# EAGLE design nol.board-feather (EAGLE 9.3.2)
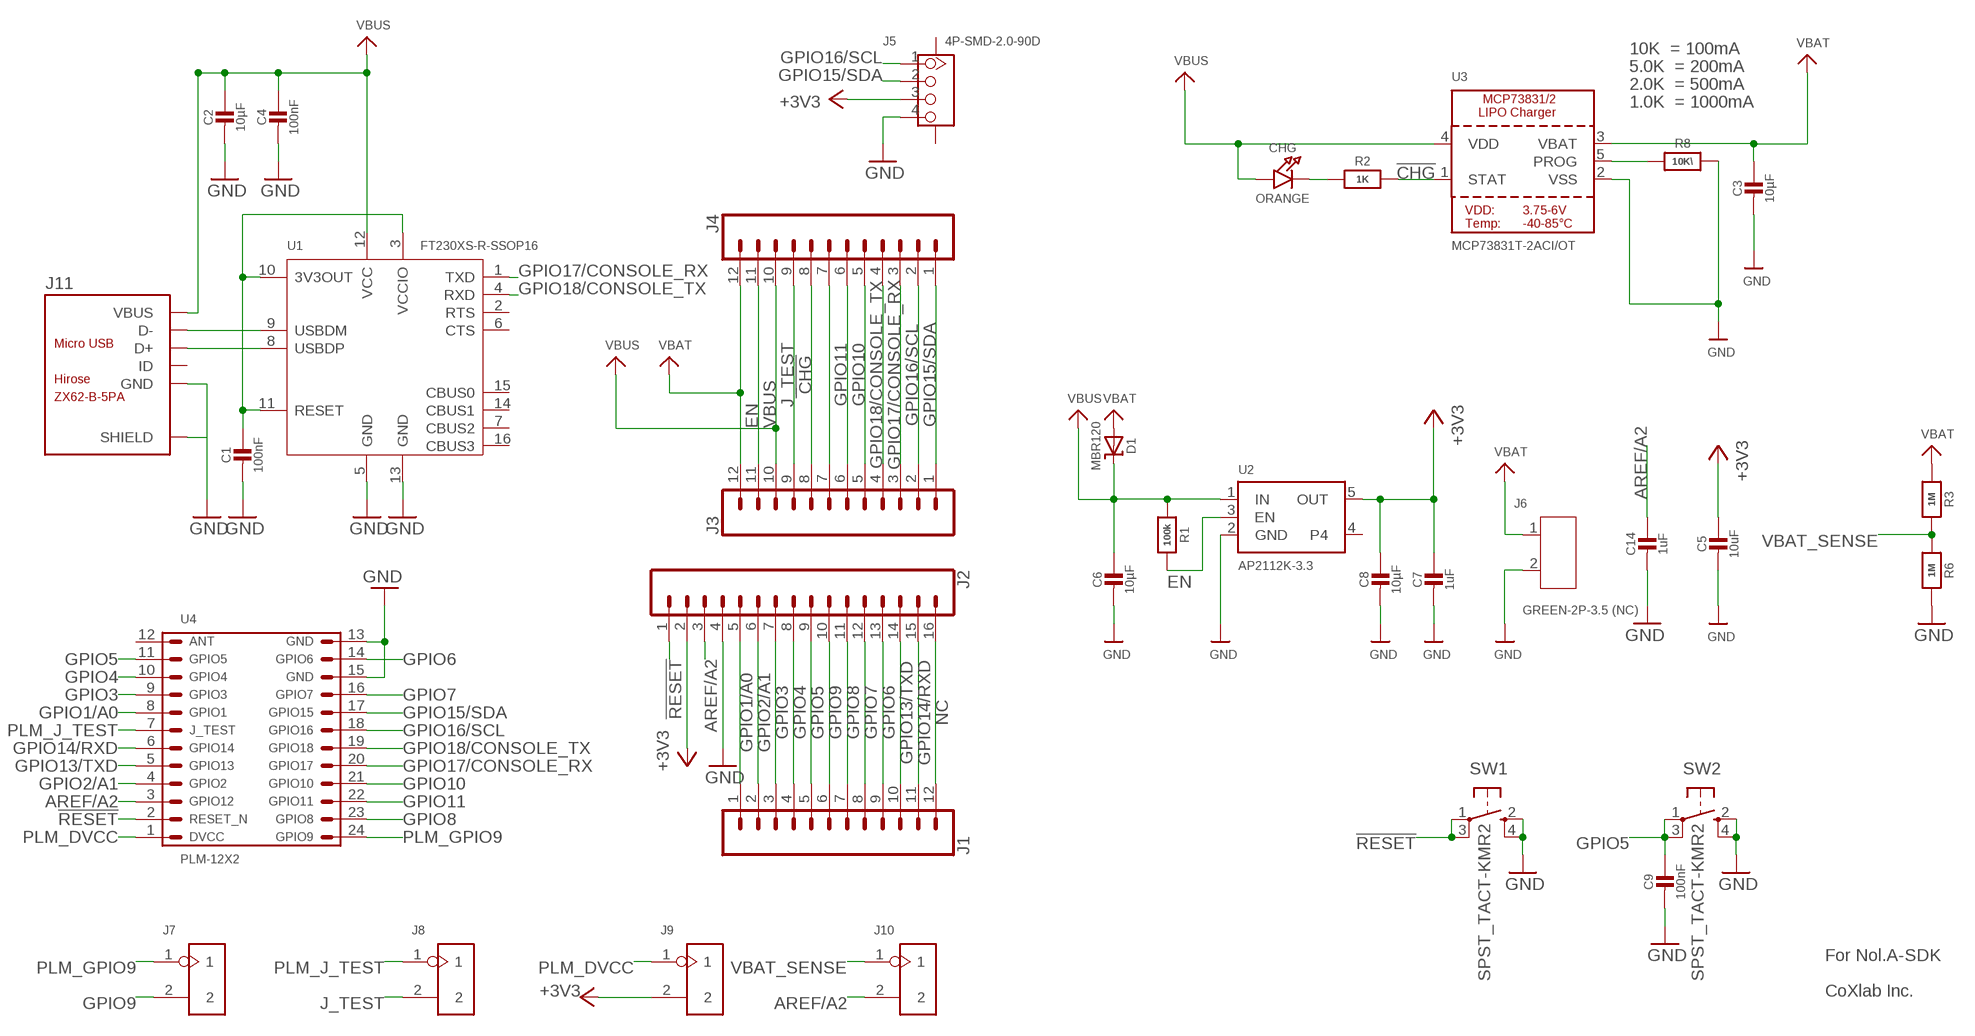
[diagram p0: schematic, sheet 1]

## Parts
C1  100nF  CAP_CERAMIC0805-NOOUTLINE  [0805-NO]
C2  10µF  CAP_CERAMIC0805-NOOUTLINE  [0805-NO]
C3  10µF  CAP_CERAMIC0805-NOOUTLINE  [0805-NO]
C4  100nF  CAP_CERAMIC0805-NOOUTLINE  [0805-NO]
C5  10uF  CAP_CERAMIC0805-NOOUTLINE  [0805-NO]
C6  10µF  CAP_CERAMIC0805-NOOUTLINE  [0805-NO]
C7  1uF  CAP_CERAMIC0603_NO  [0603-NO]
C8  10µF  CAP_CERAMIC0805-NOOUTLINE  [0805-NO]
C9  100nF  CAP_CERAMIC0805-NOOUTLINE  [0805-NO]
C14  1uF  CAP_CERAMIC0603_NO  [0603-NO]
CHG  ORANGE  LED0805_NOOUTLINE  [CHIPLED_0805_NOOUTLINE]
D1  MBR120  DIODE-SCHOTTKYSOD-123  [SOD-123]
J1  CONN_12  [1X12]
J2  CONN_16  [1X16]
J3  CONN_12  [1X12]
J4  CONN_12  [1X12]
J5  4P-SMD-2.0-90D  GROVE-CONNECTOR-SMD-90D(4+2P-2.0)  [HW4-SMD-2.0-90D]
J6  GREEN-2P-3.5 (NC)  SCREW-TERMINAL-GREEN(2P-3.5)  [H2-3.5-7.0X7.0MM]
J7  DIP-BLACK-JUMPER  [H2-2.54]
J8  DIP-BLACK-JUMPER  [H2-2.54]
J9  DIP-BLACK-JUMPER  [H2-2.54]
J10  DIP-BLACK-JUMPER  [H2-2.54]
J11  ZX62-B-5PA  MICRO-USB-SMD(ZX62-B-5PA)  [MICRO-USB5+6P-SMD-0.65-AB]
R1  100k  RESISTOR_0603_NOOUT  [0603-NO]
R2  1K  RESISTOR_0603_NOOUT  [0603-NO]
R3  1M  RESISTOR_0603_NOOUT  [0603-NO]
R6  1M  RESISTOR_0603_NOOUT  [0603-NO]
R8  10K\  RESISTOR_0603_NOOUT  [0603-NO]
SW1  SPST_TACT-KMR2  [KMR2]
SW2  SPST_TACT-KMR2  [KMR2]
U1  FT230XS-R-SSOP16  INTERFACE-FT230XS-R(SSOP16)  [SSOP16-0.635-5X4MM]
U2  AP2112K-3.3  VREG_SOT23-5  [SOT23-5]
U3  MCP73831T-2ACI/OT  MCP73831/2  [SOT23-5]
U4  PLM-12X2  [PLM-12X2]
U$1  COXLAB5X5MM  [COXLAB_5X5MM]
U$7  NOLA10X10MM  [NOLA_10X10MM]

## Nets
!CHG: J3.8 J4.8 R2.2 U3.1(STAT)
!RESET: J2.1 SW1.1(P) SW1.3(P1) U4.2
+3V3: C5.1 C7.1 C8.1 J2.2 J5.3 J9.2 U2.5(OUT)
AREF/A2: C14.1 J2.3 J10.2 U4.3
EN: J3.11 J4.11 R1.2 U2.3(EN)
GND: C1.2 C2.2 C3.2 C4.2 C5.2 C6.2 C7.2 C8.2 C9.2 C14.2 J2.4 J5.4 J6.2 J11.5(GND) J11.P1(SHIELD) J11.P2(SHIELD) J11.P3(SHIELD) J11.P4(SHIELD) J11.P5(SHIELD) J11.P6(SHIELD) R6.2 R8.2 SW1.2(S) SW1.4(S1) SW2.2(S) SW2.4(S1) U1.5(GND) U1.13(GND) U2.2(GND) U3.2(VSS) U4.13 U4.15
GPIO1/A0: J1.1 J2.5 U4.8
GPIO2/A1: J1.2 J2.6 U4.4
GPIO3: J1.3 J2.7 U4.9
GPIO4: J1.4 J2.8 U4.10
GPIO5: C9.1 J1.5 J2.9 SW2.1(P) SW2.3(P1) U4.11
GPIO6: J1.9 J2.13 U4.14
GPIO7: J1.8 J2.12 U4.16
GPIO8: J1.7 J2.11 U4.23
GPIO9: J1.6 J2.10 J7.2
GPIO10: J3.5 J4.5 U4.21
GPIO11: J3.6 J4.6 U4.22
GPIO13/TXD: J1.10 J2.14 U4.5
GPIO14/RXD: J1.11 J2.15 U4.6
GPIO15/SDA: J3.1 J4.1 J5.2 U4.17
GPIO16/SCL: J3.2 J4.2 J5.1 U4.18
GPIO17/CONSOLE_RX: J3.3 J4.3 U1.1(TXD) U4.20
GPIO18/CONSOLE_TX: J3.4 J4.4 U1.4(RXD) U4.19
J_TEST: J3.9 J4.9 J8.2
N$1: J11.2(D-) U1.9(USBDM)
N$2: J11.3(D+) U1.8(USBDP)
N$3: C1.1 U1.3(VCCIO) U1.10(3V3OUT) U1.11(RESET)
N$7: J3.7 J4.7
N$16: CHG.C R2.1
N$29: R8.1 U3.5(PROG)
NC: J1.12 J2.16
PLM_DVCC: J9.1 U4.1
PLM_GPIO9: J7.1 U4.24
PLM_J_TEST: J8.1 U4.7
VBAT: C3.1 D1.A J3.12 J4.12 J6.1 R3.1 U3.3(VBAT)
VBAT_SENSE: J10.1 R3.2 R6.1
VBUS: C2.1 C4.1 C6.1 CHG.A D1.C J3.10 J4.10 J11.1(VBUS) R1.1 U1.12(VCC) U2.1(IN) U3.4(VDD)
Unconnected: J5.SS1 J5.SS2 J11.4(ID) U1.2(RTS) U1.6(CTS) U1.7(CBUS2) U1.14(CBUS1) U1.15(CBUS0) U1.16(CBUS3) U2.4 U4.12

## Notes on the sheet
- 10K  = 100mA
- 5.0K  = 200mA
- 2.0K  = 500mA
- 1.0K  = 1000mA

## Library data of the parts
C1-C9 C14 = microbuilder:CAP_CERAMIC: Ceramic Capacitors For new designs, use the packages preceded by an '_' character since they are more reliable: The following footprints should be used on most boards: _0402 - Standard footprint for regular board layouts _0603 - Standard footprint for regular board layouts _0805 - Standard footprint for regular board layouts _1206 - Standard footprint for regular board layouts For extremely tight-pitch boards where space is at a premium, the following 'micro-pitch' footprints can be used (smaller pads, no silkscreen outline, etc.): _0402MP - Micro-pitch footprint for very dense/compact boards _0603MP - Micro-pitch footprint for very dense/compact boards _0805MP - Micro-pitch footprint for very dense/compact boards _1206MP - Micro-pitch footprint for very dense/compact boards
CHG = microbuilder:LED: LED 0603 - 0603 Surface Mount Package 2mA: Green LED - Low Power (3.9mcd, 2ma, 1.7Vf) - Digikey: 475-2709-2-ND Orange LED - Low Power (9.8mcd, 2ma, 1.8Vf) - Digikey: 475-1194-2-ND Red LED - Low Power (5mcd, 2ma, 1.8Vf) - Digikey: 475-1195-2-ND Yellow LED - Low Power (7mcd, 2ma, 1.8Vf) - Digikey: 475-1196-2-ND 5mA: Blue LED - Low Power (17mcd, 5ma, 2.9Vf) - Digikey: LNJ937W8CRACT-ND 0805 - 0805 Surface Mount Package 2mA: Red LED (8.8mcd, 2mA, 1.8Vf, Clear) - Low Power [Digikey: 475-2510-1-ND] Green LED (5mcd, 2mA, 1.8Vf, Clear) - Low Power [Digikey: 475-2730-1-ND] Yellow LED (11.3mcd, 2mA, 1.8Vf, Clear) - Low Power [Digikey: 475-2555-1-ND] 20mA: Red LED (104mcd, 20mA, Diffused) - LS R976 [Digikey: 475-1278-6-ND] Red LED (12mcd, 20mA, 2.0Vf, Clear) - APT2012EC [Digikey: 754-1128-1-ND] Green LED (15mcd, 20mA, 2.2Vf, Clear) - APT2012GC [Digikey: 754-1131-1-ND] Orange LED (160mcd, 20mA, 2.1Vf, Clear) - APT2012SECK [Digikey: 754-1130-1-ND] 1206 - 1206 Surface Mount Package Green LED (26mcd, 20mA, Diffused) - LG N971 [Digikey: 475-1407-6-ND] Red LED (15mcd, 20mA, Diffused) - LH N974 [Digikey: 475-1416-6-ND] Cree - Cree High-Power Surface Mount LEDs XPEBWT-L1-0000-00D50 - White 111lm 350mA 2.9Vf 6200K 110° XTEAWT-00-0000-00000LEE3 - White 114lm 350mA 2.85Vf 5000K 115° Everlight - Everlight 45-21 Series Surface Mount LEDs 45-21/QK2C-B2832AC2CB2/2T - Warm White 2000mcd 20mA 3.25Vf 3050K 120° 45-21/LK2C-B38452C4CB2/2T - Nuetral White 2000mcd 20mA 3.25Vf 4150K 120° 45-21/LK2C-B50634C6CB2/2T - Cold White 2200mcd 20mA 3.25Vf 5650K 120° PLCC2 Reverse Mount LS T77K-J1L2-1-0-2-R18-Z - Red 11.25mcd 2mA 1.8Vf 630nm 120° LO T77K-L1M2-24-Z - Orange 19.6mcd 2mA 1.8Vf 606nm 120° LY T77K-K2M1-26-Z - Yellow 15.7mcd 2mA 1.8Vf 587nm 120°
D1 = microbuilder:DIODE-SCHOTTKY
J1 J3 J4 = SparkFun-Connectors:CONN_12: Multi connection point. Often used as Generic Header-pin footprint for 0.1 inch spaced/style header connections On any of the 0.1 inch spaced packages, you can populate with these: Break Away Headers - Straight <https://www.sparkfun.com/products/116> (PRT-00116) Break Away Male Headers - Right Angle <https://www.sparkfun.com/products/553> (PRT-00553) Female Headers <https://www.sparkfun.com/products/115> (PRT-00115) Break Away Headers - Machine Pin <https://www.sparkfun.com/products/117> (PRT-00117) Break Away Female Headers - Swiss Machine Pin <https://www.sparkfun.com/products/743> (PRT-00743) For SCREWTERMINALS and SPRING TERMINALS visit here: Screw Terimnals on SparkFun.com <https://www.sparkfun.com/search/results?term=Screw+Terminals> (5mm/3.5mm/2.54mm spacing) This device is also useful as a general connection point to wire up your design to another part of your project. Our various solder wires solder well into these plated through hole pads. Hook-Up Wire - Assortment (Stranded, 22 AWG) <https://www.sparkfun.com/products/11375> (PRT-11375) Hook-Up Wire - Assortment (Solid Core, 22 AWG) <https://www.sparkfun.com/products/11367> (PRT-11367) View the entire wire category on our website here <https://www.sparkfun.com/categories/141> Special notes: Molex polarized connector foot print use with SKU : PRT-08231 with associated crimp pins and housings. 1MM SMD Version SKU: PRT-10208 NOTES ON THE VARIANTS LOCK and LOCK_LONGPADS... This footprint was designed to help hold the alignment of a through-hole component (i.e. 6-pin header) while soldering it into place. You may notice that each hole has been shifted either up or down by 0.005 of an inch from it's more standard position (which is a perfectly straight line). This slight alteration caused the pins (the squares in the middle) to touch the edges of the holes. Because they are alternating, it causes a "brace" to hold the component in place. 0.005 has proven to be the perfect amount of "off-center" position when using our standard breakaway headers. Although looks a little odd when you look at the bare footprint, once you have a header in there, the alteration is very hard to notice. Also,if you push a header all the way into place, it is covered up entirely on the bottom side.
J2 = SparkFun-Connectors:CONN_16: Multi connection point. Often used as Generic Header-pin footprint for 0.1 inch spaced/style header connections On any of the 0.1 inch spaced packages, you can populate with these: Break Away Headers - Straight <https://www.sparkfun.com/products/116> (PRT-00116) Break Away Male Headers - Right Angle <https://www.sparkfun.com/products/553> (PRT-00553) Female Headers <https://www.sparkfun.com/products/115> (PRT-00115) Break Away Headers - Machine Pin <https://www.sparkfun.com/products/117> (PRT-00117) Break Away Female Headers - Swiss Machine Pin <https://www.sparkfun.com/products/743> (PRT-00743) For SCREWTERMINALS and SPRING TERMINALS visit here: Screw Terimnals on SparkFun.com <https://www.sparkfun.com/search/results?term=Screw+Terminals> (5mm/3.5mm/2.54mm spacing) This device is also useful as a general connection point to wire up your design to another part of your project. Our various solder wires solder well into these plated through hole pads. Hook-Up Wire - Assortment (Stranded, 22 AWG) <https://www.sparkfun.com/products/11375> (PRT-11375) Hook-Up Wire - Assortment (Solid Core, 22 AWG) <https://www.sparkfun.com/products/11367> (PRT-11367) View the entire wire category on our website here <https://www.sparkfun.com/categories/141> Special notes: Molex polarized connector foot print use with SKU : PRT-08231 with associated crimp pins and housings. 1MM SMD Version SKU: PRT-10208 NOTES ON THE VARIANTS LOCK and LOCK_LONGPADS... This footprint was designed to help hold the alignment of a through-hole component (i.e. 6-pin header) while soldering it into place. You may notice that each hole has been shifted either up or down by 0.005 of an inch from it's more standard position (which is a perfectly straight line). This slight alteration caused the pins (the squares in the middle) to touch the edges of the holes. Because they are alternating, it causes a "brace" to hold the component in place. 0.005 has proven to be the perfect amount of "off-center" position when using our standard breakaway headers. Although looks a little odd when you look at the bare footprint, once you have a header in there, the alteration is very hard to notice. Also,if you push a header all the way into place, it is covered up entirely on the bottom side.
J5 = OPL_Connector:GROVE-CONNECTOR-SMD-90D(4+2P-2.0): 320110032
J6 = OPL_Connector:SCREW-TERMINAL-GREEN(2P-3.5): 320110028; VALUE: GREEN-2P-3.5
J7-J10 = OPL_Connector:DIP-BLACK-JUMPER: 320190003
J11 = OPL_Connector:MICRO-USB-SMD(ZX62-B-5PA): 320010005; MPN: ZX62-B-5PA
R1-R3 R6 R8 = microbuilder:RESISTOR: Resistors For new designs, use the packages preceded by an '_' character since they are more reliable: The following footprints should be used on most boards: _0402 - Standard footprint for regular board layouts _0603 - Standard footprint for regular board layouts _0805 - Standard footprint for regular board layouts _1206 - Standard footprint for regular board layouts For extremely tight-pitch boards where space is at a premium, the following 'micro-pitch' footprints can be used (smaller pads, no silkscreen outline, etc.): _0402MP - Micro-pitch footprint for very dense/compact boards _0603MP - Micro-pitch footprint for very dense/compact boards _0805MP - Micro-pitch footprint for very dense/compact boards _1206MP - Micro-pitch footprint for very dense/compact boards
SW1 SW2 = adafruit:SPST_TACT: SMT 6mm switch, EVQQ2 series http://www.ladyada.net/library/eagle
U1 = OPL_IC:INTERFACE-FT230XS-R(SSOP16): 310070030; MPN: FT230XS-R
U2 = microbuilder:VREG_SOT23-5: SOT23-5 Fixed Voltage Regulators Part Current Out V Out V In V Dropout θJA (°C/W) TJ (°C) Digikey Part No. ADP121 150mA 3.3V 3.4-5.5V 0.09V @ 150mA -- -- ADP121-AUJZ33R7CT-ND ADP121 150mA 3.0V 3.1-5.5V 0.09V @ 150mA -- -- ADP121-AUJZ30R7CT-ND ADP122 300mA 3.3V 3.4-5.5V 0.085V @ 300mA -- -- ADP122AUJZ-3.3-R7CT-ND ADP1712 300mA 3.3V 3.5-5.5V 0.17V @ 300mA -- -- ADP1712AUJZ-3.3-R7TR-ND AP7311 (Low Cost) 150mA 3.3V 3.5-6V 0.15V @ 150mA -- -- AP7311-33WG-7DICT-ND LD39015M18R 150mA 1.8V 1.9V-5.5V 0.08V @ 100mA -- -- 497-6977-1-ND LP2985A-33DBVR 150mA 3.3V 3.3-16V 0.28V @ 150mA 206 150 296-18479-1-ND MCP1824T-3302E/OT 300mA 3.3V 3.5V-6V 0.2V @ 300mA -- -- MCP1824T-3302E/OTCT-ND MIC5205-2.5YM5 TR 150mA 2.5V 2.7-16V 0.165V @ 150mA -- -- 576-1257-2-ND MIC5205-3.0YM5 TR 150mA 3.0V 3.2V-16V 0.165V @ 150mA -- -- 576-1258-2-ND MIC5205-3.3YM5 TR 150mA 3.3V 3.5V-16V 0.165V @ 150mA -- -- 576-1259-2-ND TPS780330220 150mA 3.3V+2.2V 3.6-5.5V 250mV Max -- -- 296-23332-1-ND TDA3663/N1,135 100mA 3.3V 3.5-45V 0.18V @ 50mA -- -- 568-5343-1-ND Max operating temp can be calculated using θJA, TJ (max junction temperature), and power in watts. Set the "Maximum Ambient Temperature" until it reaches TJ ("Max Junction Temperature"), which is the absolute limit for safe use of the regulator: Heat Sink Temperature Calculator <http://www.daycounter.com/Calculators/Heat-Sink-Temperature-Calculator.phtml> For example, With 12V source into a 3.3V LP2985 and a 30mA load, we are dissipating (12V-3.3V) * 0.03A = 0.261W. With a θJA of 206 °C/W, a TJ of 150°C, and 261mW we can safely use the chip without a heat sink up to 75°C (=147.1°C Junction Temperature).
U3 = microbuilder:MCP73831/2: MCP73831/2 LIPO Charger VDD: 3.75 - 6V Temp -40 - 85°C Programmable Charge Rate: 15-500mA NOTE: STAT is a tri-state logic output on the MCP73831 and an open-drain output on the MCP73832. SOT23-5 with 4.2V output and tri-state logic on STAT = MCP73831T-2ACI/OT
U4 = plm:PLM-12X2
U$1 = coxlab:COXLAB
U$7 = coxlab:NOLA

## Board
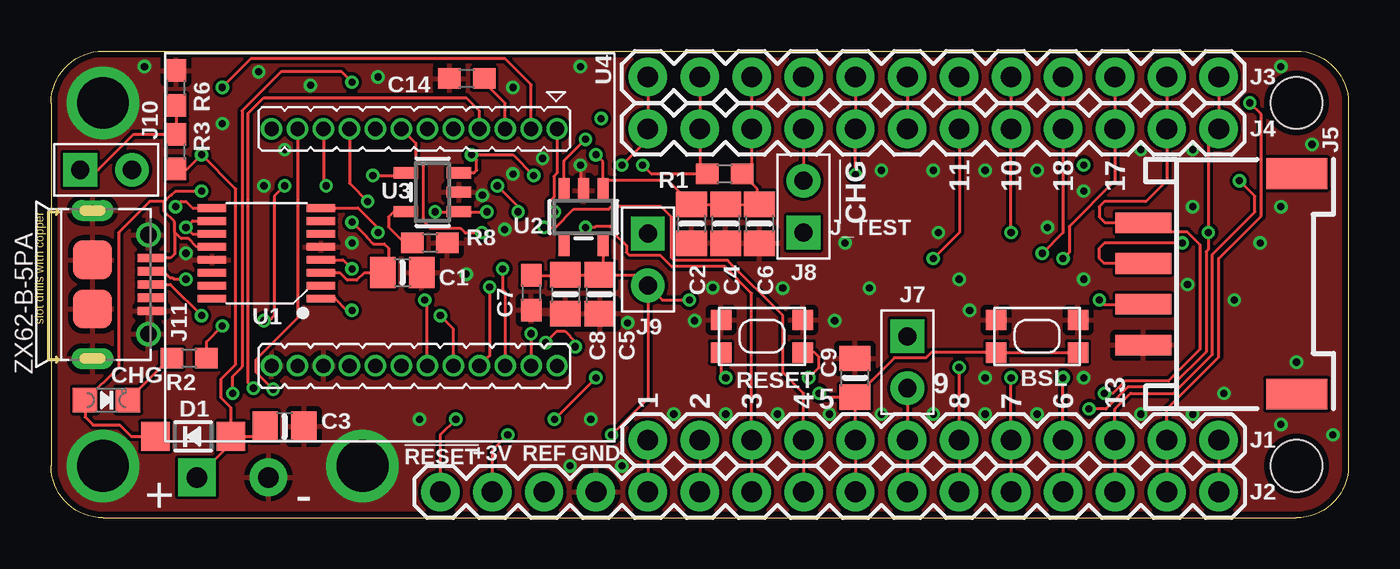
[diagram p1: board, top side]
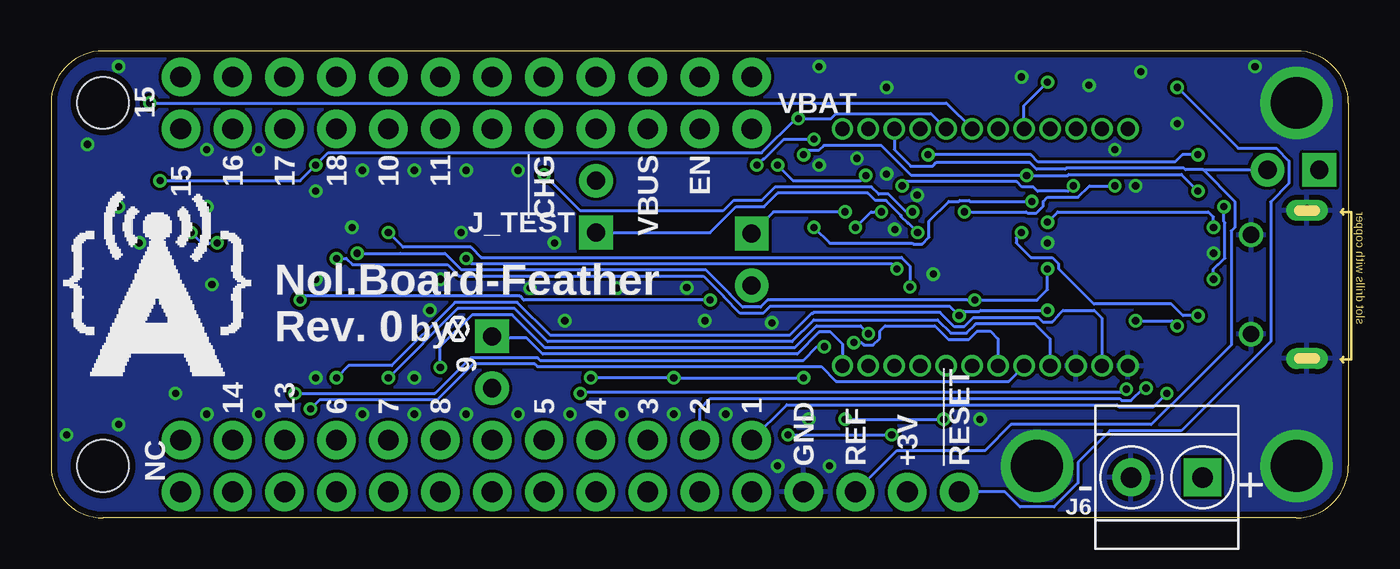
[diagram p2: board, bottom side, seen from below]

Size 63.5 x 22.86 mm. Coordinates in mm from the lower left corner, seen from the top.
Outline: 2.54,0 60.96,0 arc90 63.5,2.54 63.5,20.32 arc90 60.96,22.86 2.54,22.86 arc90 0,20.32 0,2.54 arc90 2.54,0
Copper layers (1*16): Top 0.035mm / dielectric 1.5mm / Bottom 0.035mm
Design rules "SeeedStudio_2layer_DRU_no_angle_20140221 *": minimum track width 6mil, minimum drill 0.2mm, track to track 6mil, track to pad 6mil, pad to pad 6mil, via to via 6mil, smd to smd 0mil, copper to edge 12mil, drill to drill 12mil, minimum pad ring 6mil, minimum via ring 6mil, stop-mask expansion 2mil, vias tented up to drill 100mil, thermal gap 10mil
Holes 2.54 mm at 60.96,20.32 60.96,2.54

### Footprints (pad centres in the part's own frame; a part is rotated, then mirrored left to right if it is on the bottom)
0805-NO = smd 1.24 x 1.5: 1 -0.95,0; 2 0.95,0
0603-NO = smd 1.1 x 1: 1 -0.85,0; 2 0.85,0
CHIPLED_0805_NOOUTLINE = smd 1.2 x 1.2: A 0,-1.05; C 0,1.05
SOD-123 = smd 1.4 x 1.4: A 1.85,0; C -1.85,0
1X12 = drill 1.016 pad 1.88: 1 0,0; 2 2.54,0; 3 5.08,0; 4 7.62,0; 5 10.16,0; 6 12.7,0; 7 15.24,0; 8 17.78,0; 9 20.32,0; 10 22.86,0; 11 25.4,0; 12 27.94,0
1X16 = drill 1.016 pad 1.88: 1 0,0; 2 2.54,0; 3 5.08,0; 4 7.62,0; 5 10.16,0; 6 12.7,0; 7 15.24,0; 8 17.78,0; 9 20.32,0; 10 22.86,0; 11 25.4,0; 12 27.94,0; 13 30.48,0; 14 33.02,0; 15 35.56,0; 16 38.1,0
HW4-SMD-2.0-90D = smd 1.01 x 2.74: 1 -3,-0.1; 2 -1,-0.1; 3 1,-0.1; 4 3,-0.1 | smd 1.5 x 3: SS1 -5.4,7.4; SS2 5.4,7.4
H2-3.5-7.0X7.0MM = drill 1 pad 1.85 square: 1 -1.75,0 | drill 1 pad 1.85: 2 1.75,0
H2-2.54 = drill 0.889 pad 1.651 square: 1 0,1.27 | drill 0.889 pad 1.651: 2 0,-1.27
MICRO-USB5+6P-SMD-0.65-AB = smd 0.4 x 1.35: 1 -1.3,2.875; 2 -0.65,2.875; 3 0,2.875; 4 0.65,2.875; 5 1.3,2.875 | smd 1.9 x 1.9: P1 -1.2,0; P2 1.2,0 | drill 0.508 pad 1.016 long: P3 -3.625,0; P4 3.625,0 | drill 0.8: P5 -2.425,2.73; P6 2.425,2.73
KMR2 = smd 1 x 1: 1 2,0.8; 2 2,-0.8; 3 -2,0.8; 4 -2,-0.8
SSOP16-0.635-5X4MM = smd 0.381 x 1.397: 1 -2.223,-2.667; 2 -1.587,-2.667; 3 -0.953,-2.667; 4 -0.318,-2.667; 5 0.318,-2.667; 6 0.953,-2.667; 7 1.587,-2.667; 8 2.223,-2.667; 9 2.223,2.667; 10 1.587,2.667; 11 0.953,2.667; 12 0.318,2.667; 13 -0.318,2.667; 14 -0.953,2.667; 15 -1.587,2.667; 16 -2.223,2.667
SOT23-5 = smd 0.55 x 1.2: 1 -0.95,-1.3; 2 0,-1.3; 3 0.95,-1.3; 4 0.95,1.3; 5 -0.95,1.3
PLM-12X2 = drill 0.7 pad 1.016: 1 0,0; 2 1.27,0; 3 2.54,0; 4 3.81,0; 5 5.08,0; 6 6.35,0; 7 7.62,0; 8 8.89,0; 9 10.16,0; 10 11.43,0; 11 12.7,0; 12 13.97,0; 13 13.97,11.608; 14 12.7,11.608; 15 11.43,11.608; 16 10.16,11.608; 17 8.89,11.608; 18 7.62,11.608; 19 6.35,11.608; 20 5.08,11.608; 21 3.81,11.608; 22 2.54,11.608; 23 1.27,11.608; 24 0,11.608

### Placement (x,y rotation side)
C1  17.2,12.01 0 top
C2  31.34,14.4 270 top
C3  11.43,4.47 0 top
C4  33.02,14.4 270 top
C5  26.87,10.95 270 top
C6  34.67,14.4 270 top
C7  23.5,11.02 270 top
C8  25.17,10.95 270 top
C9  39.34,6.86 90 top
C14  20.35,21.51 180 top
CHG  2.72,5.77 270 top
D1  6.96,3.99 0 top
J1  29.21,3.81 0 top
J2  19.05,1.27 0 top
J3  57.15,21.59 180 top
J4  57.15,19.05 180 top
J5  53.57,11.46 270 top
J6  8.89,1.98 180 bottom
J7  41.91,7.62 0 top
J8  36.83,15.24 180 top
J9  29.21,12.65 0 top
J10  2.69,17.04 90 top
J11  2.03,11.43 270 top
R1  32.97,16.84 180 top
R2  6.76,7.82 0 top
R3  6.12,17.93 90 top
R6  6.12,21.06 90 top
R8  18.54,13.46 0 top
SW1  34.8,8.89 180 top
SW2  48.26,8.89 180 top
U1  10.54,12.95 90 top
U2  26.06,14.73 180 top
U3  18.67,15.95 90 top
U4  24.77,19.05 180 top
U$1  44.2,8.64 0 bottom
U$7  63.25,6.6 0 bottom

### Tracks (layer width: path | path; a pad name or v marks a point on that pad's centre or on a via)
!CHG  (via drill 0.35)
  Top 0.152: U3.1 19.98,14.99 | 19.98,14.99 v21.34,14.99 | v18.8,14.99 19.98,14.99 | v11.43,16.26 10.92,15.75 10.92,9.91 10.67,9.65 v10.41,9.65 | R2.2 7.61,8.62 v8.38,9.4 | v39.37,16.8 J4.8 J3.8
  Bottom 0.152: v18.8,14.99 15.77,14.99 15.72,14.94 15.26,14.94 14.94,15.26 14.94,15.49 14.73,15.7 13.23,15.7 12.68,16.26 v11.43,16.26 | v10.41,9.65 8.64,9.65 v8.38,9.4 | v39.37,16.8 37.59,15.02 30.62,15.02 30.1,15.54 28.73,15.54 28.07,16.2 23.34,16.2 22.98,15.85 22.5,15.85 21.64,14.99 v21.34,14.99
!RESET  (via drill 0.35)
  Top 0.152: SW1.1 32.8,7.08 v33.02,6.86 | v37.08,6.86 37.59,7.37 37.59,7.87 37.38,8.09 SW1.3 | v26.67,6.86 v24.64,4.83 | v19.81,4.83 19.05,4.06 J2.1 | U4.2 23.5,21.21 22.23,22.48 9.78,22.48 v8.38,21.08
  Bottom 0.152: v37.08,6.86 v33.02,6.86 v26.67,6.86 | v24.64,4.83 v19.81,4.83 | v8.38,21.08 5.4,18.1 3.53,18.1 2.91,17.48 2.91,16.37 3.81,15.47 3.81,8.64 8.18,4.27 11.68,4.27 13.23,2.72 13.23,1.71 14.41,0.53 16.07,0.53 16.81,1.27 J2.1
+3V3  (via drill 0.35)
  Top 0.152: C7.1 25.15,11.87 C8.1 C5.1 | C5.1 28.69,11.9 J9.2 | J9.2 29.92,10.67 v31.24,10.67 | v51.31,10.67 51.52,10.46 J5.3 | J9.2 29.21,5.84 v27.43,4.06 | v22.35,4.06 21.59,3.3 J2.2 | U2.5 27.01,12.04 C5.1
  Bottom 0.152: v31.24,10.67 40.36,10.67 40.55,10.86 51.12,10.86 v51.31,10.67 | v27.43,4.06 v22.35,4.06
AREF/A2
  Top 0.152: C14.1 21.2,21.34 22.23,20.31 U4.3
  Bottom 0.152: U4.3 22.23,18.03 21.41,17.22 20.34,17.22 20.18,17.39 15.59,17.39 15.27,17.07 13.87,17.07 13.82,17.12 8.05,17.12 7.98,17.04 7.11,17.04 | 7.11,17.04 J10.2 | J2.3 22.1,3.3 17.78,3.3 16.51,4.57 9.65,4.57 8.68,5.54 8.66,5.54 5.74,8.46 5.74,14.05 5.54,14.25 5.54,15.47 7.11,17.04
EN  (via drill 0.35)
  Top 0.152: J3.11 J4.11 31.75,17.21 R1.2 29.39,16.84 v28.96,17.27 | U2.3 25.11,17.49 v26.16,18.54
  Bottom 0.152: v28.96,17.27 28.65,17.58 28.6,17.58 27.64,18.54 v26.16,18.54
GND  (via drill 0.35, 2.54)
  Top 0.152: v25.91,17.27 25.91,16.18 U2.2
  other vias: 2.54,20.32 2.54,2.54 15.24,2.54 20.32,11.94 6.6,12.95 14.73,13.46 21.11,15.8 22.2,14.12 22.61,16.84 24.05,17.6 28.22,9.55 31.5,9.65 32.38,11.28 35.81,11.25 18.03,4.83 26.42,4.83 30.48,5.08 33.02,5.08 35.56,5.08 38.1,5.08 40.64,5.08 43.18,5.08 45.72,5.08 48.26,5.08 45.72,6.86 50.55,6.86 44.96,10.16 44.45,11.68 38.35,9.65 40.06,11.25 50.55,11.68 55.63,11.43 53.34,5.08 55.88,5.08 55.88,15.24 55.88,18.03 53.34,18.03 50.55,16 48.26,17.02 45.72,17.02 43.18,17.02 40.64,17.02 60.2,22.1 61.72,18.29 60.2,15.24 60.96,7.62 59.18,13.46 57.91,10.67 62.74,4.06 60.2,4.57 57.4,6.1 10.16,21.84 8.38,19.3 4.57,22.1 16,21.59 11.43,18.03 10.41,16.26 25.91,22.1 25.4,2.54 27.94,2.54 38.86,13.46 43.43,13.97 48.77,14.22 22.61,21.08 12.7,21.18
  pour Top: 0,20.32 arc-90 2.54,22.86 3.81,22.86 60.96,22.86 arc-90 63.5,20.32 63.5,16.51 63.5,2.54 arc-90 60.96,0 55.88,0 2.54,0 arc-90 0,2.54 0,7.87
  pour Bottom: 0,20.32 arc-90 2.54,22.86 10.16,22.86 60.96,22.86 arc-90 63.5,20.32 63.5,5.08 63.5,2.54 arc-90 60.96,0 48.01,0 2.54,0 arc-90 0,2.54
GPIO1/A0  (via drill 0.35)
  Top 0.152: v8.89,6.1 8.89,6.93 9.35,7.39 9.35,19.94 11.25,21.84 14.22,21.84 v14.73,21.34 | J1.1 J2.5
  Bottom 0.152: J1.1 27.48,5.54 11.32,5.54 11.23,5.44 9.54,5.44 v8.89,6.1 | U4.8 15.88,20.19 v14.73,21.34
GPIO2/A1  (via drill 0.35)
  Top 0.152: v9.91,6.35 9.65,6.6 9.65,19.81 10.41,20.57 20.32,20.57 20.95,19.94 U4.4 | J1.2 J2.6
  Bottom 0.152: J1.2 31.75,5.33 31.24,5.84 11.2,5.84 11.1,5.75 10.64,5.75 10.04,6.35 v9.91,6.35
GPIO3  (via drill 0.35)
  Top 0.152: v26.16,14.22 26.6,14.22 26.64,14.26 27.38,14.26 27.51,14.13 27.51,13.97 28.16,13.33 28.16,13 28.29,12.87 29.81,12.87 30.37,12.3 32.99,12.3 34.29,11 J1.3 J2.7 | U4.9 14.61,16.38 v15.49,15.49
  Bottom 0.152: v15.49,15.49 18.52,15.49 18.57,15.54 19.03,15.54 19.07,15.49 19.56,15.49 20.53,14.53 20.53,13.74 20.85,13.41 21.31,13.41 21.35,13.45 25.39,13.45 v26.16,14.22
GPIO4  (via drill 0.35)
  Top 0.152: U4.10 13.34,16.38 v13.46,16.26 | v22.86,14.99 22.86,15.24 v21.84,16.26 | v24.13,14.22 24.69,14.22 25.58,15.12 27.3,15.12 27.42,15.24 29.86,15.24 30.26,14.84 30.26,14.83 30.36,14.73 30.36,12.74 30.5,12.6 33.12,12.6 35.81,9.91 35.81,7.11 36.83,6.1 J1.4 J2.8
  Bottom 0.152: v13.46,16.26 13.72,16 15.22,16 15.42,16.21 15.98,16.21 16.23,16.46 21.64,16.46 v21.84,16.26 | v24.13,14.22 23.37,14.99 v22.86,14.99
GPIO5  (via drill 0.35)
  Top 0.152: SW2.3 SW2.1 43.08,8.09 42.83,7.84 41.27,7.84 C9.1 | C9.1 39.34,3.83 J1.5 J2.9 | C9.1 37.78,5.91 v37.59,6.1 | v10.87,6.3 10.04,7.13 10.04,7.75 12.06,9.78 U4.11
  Bottom 0.152: v10.87,6.3 11.03,6.15 37.54,6.15 v37.59,6.1
GPIO6  (via drill 0.35)
  Top 0.152: v49.53,6.86 J1.9 J2.13
  Bottom 0.152: U4.14 12.06,9.78 12.45,10.16 13.97,10.16 14.18,9.95 14.18,9.93 14.5,9.6 14.96,9.6 15.17,9.81 18.36,9.81 18.82,9.35 19.28,9.35 19.99,10.06 26.16,10.06 26.21,10.01 26.29,10.01 27.36,8.94 39.06,8.94 40.68,10.55 43.73,10.55 46.83,7.46 48.93,7.46 v49.53,6.86
GPIO7  (via drill 0.35)
  Top 0.152: v46.99,6.86 J1.8 J2.12
  Bottom 0.152: U4.16 14.61,8.76 15.34,9.5 18.24,9.5 18.29,9.45 | 18.29,9.45 | 18.29,9.45 18.69,9.04 19.46,9.04 20.12,9.7 26.16,9.7 27.23,8.63 39.19,8.63 40.81,10.25 43.6,10.25 v46.99,6.86
GPIO8  (via drill 0.35)
  Top 0.152: v44.45,7.37 J1.7 J2.11 | v23.5,9.02 U4.23
  Bottom 0.152: v44.45,7.37 44.45,8.38 42.89,9.94 40.93,9.94 39.32,8.33 27.1,8.33 26.03,9.4 23.88,9.4 v23.5,9.02
GPIO9
  Top 0.152: J7.2 J1.6 J2.10
GPIO10  (via drill 0.35)
  Top 0.152: v21.46,11.3 21.46,7.95 U4.21 | v46.99,13.97 J4.5 J3.5
  Bottom 0.152: v46.99,13.97 46.28,13.26 42.95,13.26 42.44,12.75 21.87,12.75 21.46,12.34 v21.46,11.3
GPIO11  (via drill 0.35)
  Top 0.152: v43.18,12.7 44.45,13.97 J4.6 J3.6 | v22.1,12.19 22.1,11.18 22.23,11.05 U4.22
  Bottom 0.152: v22.1,12.19 22.35,12.45 42.93,12.45 v43.18,12.7
GPIO13/TXD  (via drill 0.35)
  Top 0.152: v58.17,16.51 58.92,15.75 58.92,14.98 56.84,12.9 56.84,8 54.94,6.1 52.83,6.1 52.07,5.33 J1.10 J2.14
  Bottom 0.152: v58.17,16.51 51.31,16.51 v50.55,17.27 49.94,17.88 28.73,17.88 27.05,19.56 v26.92,19.56 25.32,19.56 25.08,19.8 20.44,19.8 U4.5
GPIO14/RXD  (via drill 0.35)
  Top 0.152: v58.67,20.32 59.23,19.76 59.23,14.78 57.15,12.7 57.15,7.87 54.61,5.33 J1.11 J2.15
  Bottom 0.152: U4.6 19.68,20.32 v58.67,20.32
GPIO15/SDA  (via drill 0.35)
  Top 0.152: v55.37,13.46 51.56,13.46 51.31,13.21 51.31,12.7 51.55,12.46 J5.2 | J3.1 J4.1 56.64,18.54 v56.64,13.97 56.64,13.13 56.54,13.03 56.54,8.13 54.81,6.4 52.71,6.4 51.64,5.33 v50.8,5.33
  Bottom 0.152: v56.64,13.97 56.13,13.46 v55.37,13.46 | v50.8,5.33 50.34,5.79 44.58,5.79 42.84,7.53 39.81,7.53 39.7,7.41 25.8,7.41 25.08,6.69 16.63,6.69 U4.17
GPIO16/SCL  (via drill 0.35)
  Top 0.152: J3.2 J4.2 54.61,16.51 53.59,15.49 51.56,15.49 51.31,15.24 51.31,14.73 51.59,14.46 J5.1 53.91,14.02 55.6,14.02 56.24,13.38 56.24,8.25 54.69,6.71 52.58,6.71 51.97,6.1 v51.56,6.1 | v24.21,8.59 24.77,9.14 25.15,9.14 25.65,8.64 v25.65,8.38
  Bottom 0.152: v51.56,6.1 44.7,6.1 42.96,7.84 39.69,7.84 39.57,7.72 26.67,7.72 26.01,8.38 v25.65,8.38 | v24.21,8.59 23.85,8.59 23.73,8.46 23.27,8.46 22.94,8.79 22.94,9.14 22.68,9.4 20.24,9.4 19.59,8.74 18.57,8.74 18.16,9.14 17.53,9.14 17.14,8.76 U4.18
GPIO17/CONSOLE_RX  (via drill 0.35)
  Top 0.152: v14.73,10.16 14.48,10.16 13.91,10.73 U1.1 | v49.53,12.7 49.84,13.01 49.84,14.28 52.07,16.51 J4.3 J3.3 | v19.05,9.91 19.68,9.27 U4.20
  Bottom 0.152: v49.53,12.7 49.05,12.7 48.74,12.4 44.09,12.4 43.53,11.84 31.57,11.84 30.57,10.83 30.57,10.82 29.77,10.02 28.65,10.02 28.3,10.36 19.51,10.36 v19.05,9.91 18.84,10.11 18.06,10.11 18.01,10.16 v14.73,10.16
GPIO18/CONSOLE_TX  (via drill 0.35)
  Top 0.152: U1.4 14.29,12.64 v14.73,12.19 | U4.19 18.41,10.54 v18.29,10.67 | v48.51,12.95 49.53,13.97 J4.4 J3.4
  Bottom 0.152: v48.51,12.95 46.41,12.95 46.4,12.95 44.22,12.95 43.41,12.14 31.45,12.14 30.26,10.96 30.26,10.94 29.65,10.32 28.77,10.32 28.43,10.67 v18.29,10.67 15.24,10.67 14.73,11.18 v14.73,12.19
J_TEST
  Top 0.152: J8.2 J4.9 J3.9
N$1  (via drill 0.35)
  Top 0.152: v6.1,15.24 6.35,15.49 6.6,15.49 6.92,15.18 U1.9 | v6.6,11.68 6.02,11.68 5.97,11.73 5.84,11.73 5.5,12.08 J11.2
  Bottom 0.152: v6.6,11.68 6.6,12.19 6.4,12.4 6.37,12.4 6.05,12.72 6.05,14.45 6.1,14.5 v6.1,15.24
N$2  (via drill 0.35)
  Top 0.152: J11.3 5.84,11.43 v7.37,9.91 | v16,13.97 16,14.2 15.03,15.18 U1.8
  Bottom 0.152: v16,13.97 16.26,13.72 16.26,13.46 15.54,12.75 14.5,12.75 14.18,12.42 14.18,12.19 12.45,10.46 8.66,10.46 8.1,9.91 v7.37,9.91
N$3  (via drill 0.35)
  Top 0.152: U1.10 6.92,14.54 v6.6,14.22 6.92,13.91 U1.11 | U1.3 14.14,12 14.5,11.64 14.96,11.64 15.33,12 16.23,12 C1.1 16.25,12.46 16.51,12.72 16.51,13.21 16.3,13.41 15.77,13.41 15.45,13.74 15.45,13.76 v14.73,14.48
  Bottom 0.152: v6.6,14.22 6.6,14.73 6.86,14.99 14.22,14.99 v14.73,14.48
N$7
  Top 0.152: J3.7 J4.7
N$16
  Top 0.152: CHG.C 5.83,7.82 R2.1
N$29
  Top 0.152: U3.5 16.78,15 16.51,14.73 16.51,14.25 17.3,13.46 R8.1
NC
  Top 0.152: J1.12 J2.16
PLM_DVCC  (via drill 0.35)
  Top 0.152: v24.64,14.99 24.38,15.24 24.38,15.49 24.61,15.72 24.61,16.73 24.77,16.89 U4.1
  Bottom 0.152: v24.64,14.99 28.14,14.99 J9.1
PLM_GPIO9
  Bottom 0.152: U4.24 24.77,8.51 25.35,9.09 25.91,9.09 26.98,8.02 39.44,8.02 40.22,8.8 41.82,8.8 J7.1
PLM_J_TEST  (via drill 0.35)
  Top 0.152: U4.7 17.84,18.35 17.84,17.62 18.2,17.27 18.2,14.57 18.57,14.19 20.04,14.19 20.26,13.97 v21.08,13.97
  Bottom 0.152: v21.08,13.97 21.54,14.43 21.57,14.43 21.89,14.76 21.89,14.8 22.63,15.54 23.16,15.54 23.52,15.9 27.94,15.9 28.6,15.24 29.97,15.24 31.24,13.97 J8.1
VBAT  (via drill 0.35)
  Top 0.152: R3.1 6.67,17.08 v7.37,17.78 9.04,16.1 9.04,7.52 8.33,6.81 8.33,5.87 8.81,5.39 D1.A | U3.3 20.71,16.9 20.83,17.02 20.83,17.53 v20.57,17.78 22.61,17.78 v23.62,16.76 | D1.A 8.81,3.65 J6.1 | D1.A 10,3.99 C3.1 | v27.94,17.27 29.21,18.54 J4.12 J3.12
  Bottom 0.152: v27.94,17.27 27.18,16.51 23.88,16.51 v23.62,16.76 | v7.37,17.78 8.13,17.78 8.49,17.42 15.19,17.42 15.55,17.78 v20.57,17.78
VBAT_SENSE
  Top 0.152: J10.1 2.31,17.04 4.05,18.78 6.1,18.78 | 6.1,18.78 R3.2 | R6.1 6.12,18.81 6.1,18.78
VBUS  (via drill 0.35)
  Top 0.152: J11.1 5.85,12.73 6.05,12.93 6.05,13.99 | 5.54,15.47 5.54,15.01 6.05,14.5 6.05,13.99 | 5.54,15.47 5.87,15.8 5.89,15.8 6.1,16 v7.37,16 | v15.75,16.76 17.23,16.76 U3.4 | D1.C 3.93,3.99 3.37,4.55 2.06,4.55 1.67,4.94 CHG.A 1.7,5.77 3.3,7.37 3.3,13.97 4.83,15.49 5.52,15.49 5.54,15.47 | U2.1 27.01,16.51 | 27.01,16.51 27.01,17.44 v26.67,17.78 | C6.1 34.67,15.6 34.57,15.49 | 34.57,15.49 34.57,16.09 R1.1 34.29,17.31 J4.10 J3.10 | 34.57,15.49 34.43,15.35 C4.1 C2.1 30.18,16.51 27.01,16.51 | U1.12 7.12,13.27 6.73,13.67 6.37,13.67 6.05,13.99
  Bottom 0.152: v7.37,16 8.18,16.81 13.69,16.81 13.74,16.76 v15.75,16.76 21.39,16.76 22.86,18.24 25.68,18.24 25.93,17.99 26.46,17.99 v26.67,17.78

### Text on the board
tPlace: !CHG | 11 | 10 | 18 | 17 | J_TEST | 9 | RESET | 5 | BSL | 1 | 2 | 3 | 4 | 8 | 7 | 6 | 13 | !RESET | +3V | REF | GND | + | -
bPlace: VBAT | 15 | EN | VBUS | !CHG | 11 | 10 | 18 | 17 | 16 | 15 | J_TEST | by | Nol.Board-Feather / Rev. 0 | 9 | 1 | 2 | 3 | 4 | 5 | 8 | 7 | 6 | 13 | 14 | + | - | !RESET | +3V | REF | GND | NC